# Altium schematic sheet P03_GPIO.SchDoc
size C; SheetNumber: 3; SheetTotal: 3
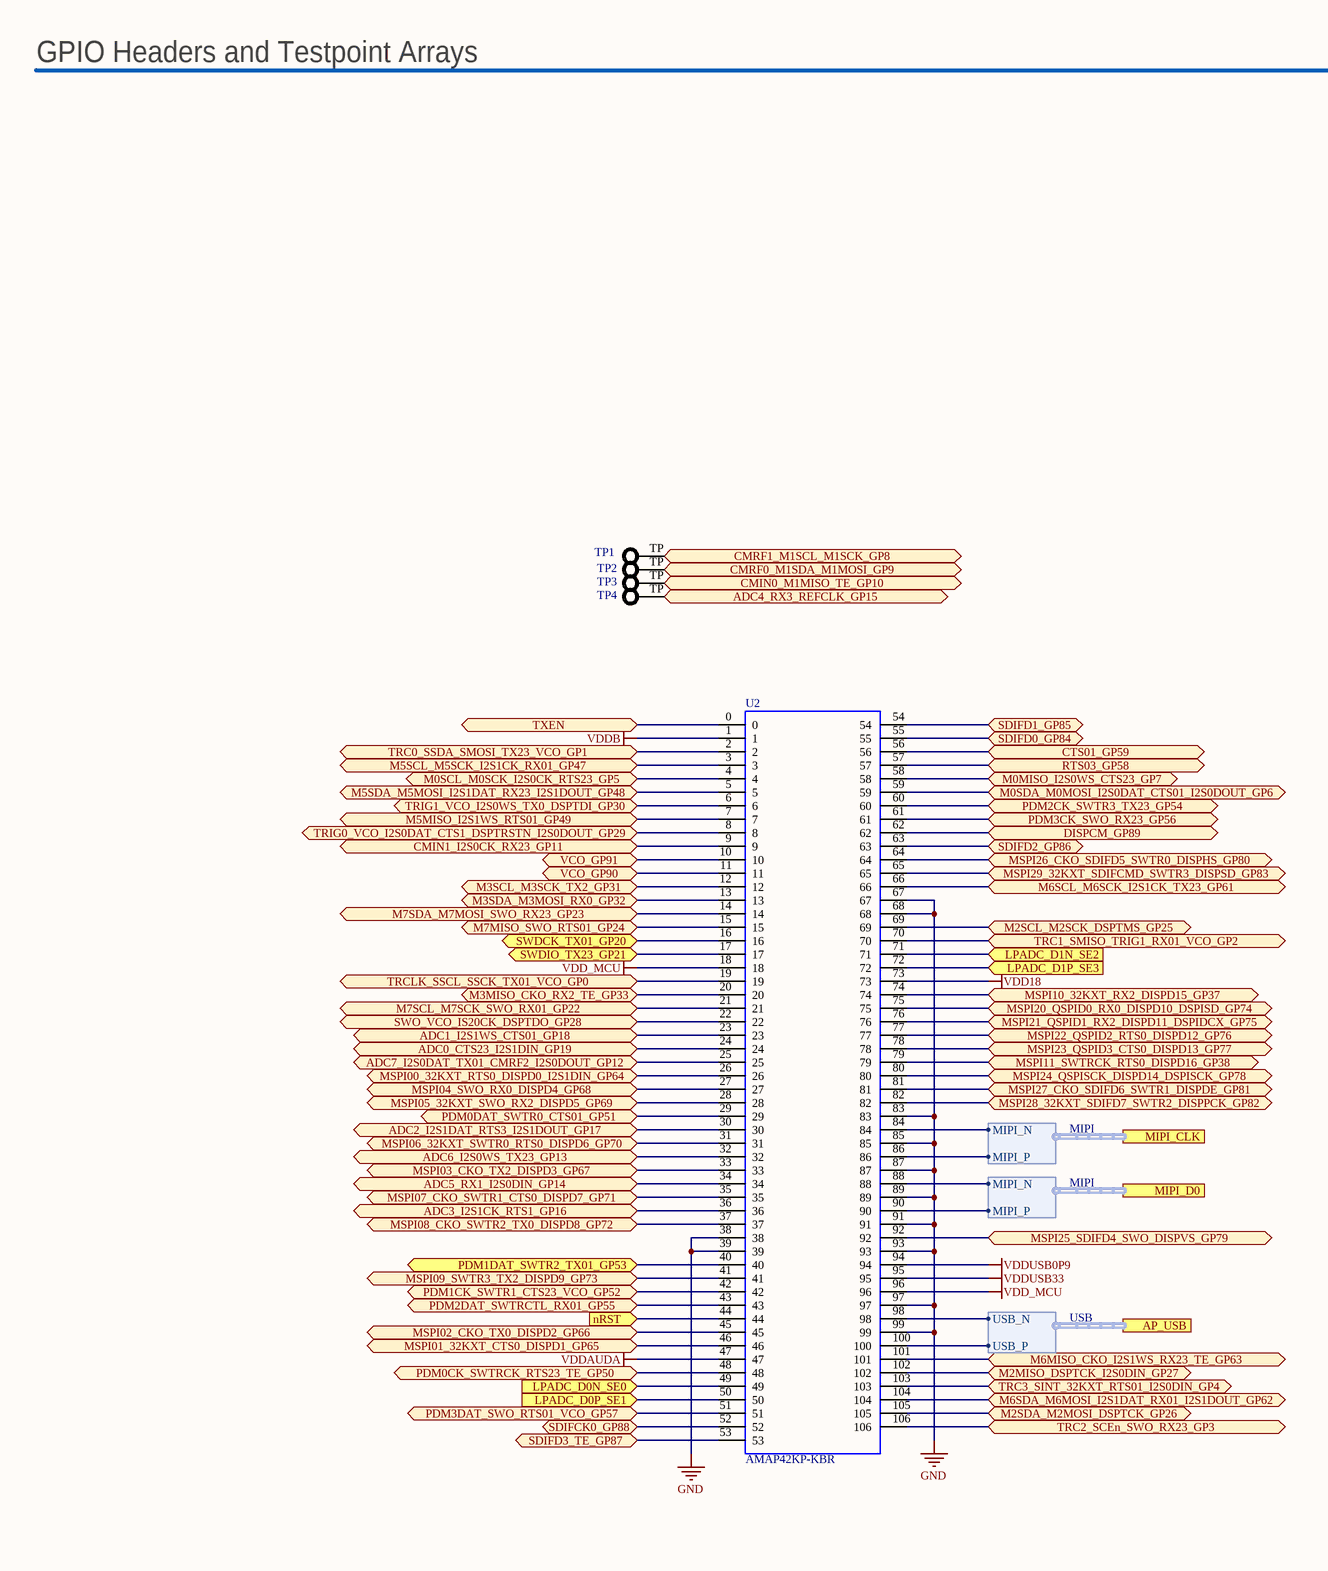
[diagram p0: P03_GPIO.SchDoc, left]
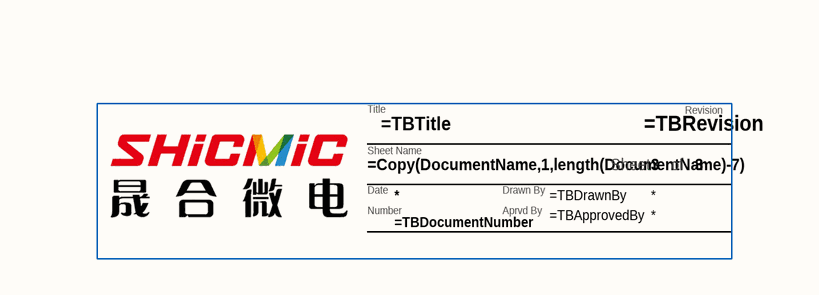
[diagram p1: P03_GPIO.SchDoc, right]

## Parts
??  TitleBlock  (value not drawn)  (graphical)
TP1  PAD  [TPPAD_0.5mm]  (value not drawn)  (no BOM)
TP2  PAD  [TPPAD_0.5mm]  (value not drawn)  (no BOM)
TP3  PAD  [TPPAD_0.5mm]  (value not drawn)  (no BOM)
TP4  PAD  [TPPAD_0.5mm]  (value not drawn)  (no BOM)
U2  AMAP42KP-KBR  [Apollo_4B]

## Ports
ADC0_CTS23_I2S1DIN_GP19 (bidir), ADC1_I2S1WS_CTS01_GP18 (bidir), ADC2_I2S1DAT_RTS3_I2S1DOUT_GP17 (bidir), ADC3_I2S1CK_RTS1_GP16 (bidir), ADC4_RX3_REFCLK_GP15 (bidir), ADC5_RX1_I2S0DIN_GP14 (bidir), ADC6_I2S0WS_TX23_GP13 (bidir), ADC7_I2S0DAT_TX01_CMRF2_I2S0DOUT_GP12 (bidir), AP_USB (harness USB), CMIN0_M1MISO_TE_GP10 (bidir), CMIN1_I2S0CK_RX23_GP11 (bidir), CMRF0_M1SDA_M1MOSI_GP9 (bidir), CMRF1_M1SCL_M1SCK_GP8 (bidir), CTS01_GP59 (bidir), DISPCM_GP89 (bidir), LPADC_D0N_SE0 (in), LPADC_D0P_SE1 (in), LPADC_D1N_SE2 (in), LPADC_D1P_SE3 (in), M0MISO_I2S0WS_CTS23_GP7 (bidir), M0SCL_M0SCK_I2S0CK_RTS23_GP5 (bidir), M0SDA_M0MOSI_I2S0DAT_CTS01_I2S0DOUT_GP6 (bidir), M2MISO_DSPTCK_I2S0DIN_GP27 (bidir), M2SCL_M2SCK_DSPTMS_GP25 (bidir), M2SDA_M2MOSI_DSPTCK_GP26 (bidir), M3MISO_CKO_RX2_TE_GP33 (bidir), M3SCL_M3SCK_TX2_GP31 (bidir), M3SDA_M3MOSI_RX0_GP32 (bidir), M5MISO_I2S1WS_RTS01_GP49 (bidir), M5SCL_M5SCK_I2S1CK_RX01_GP47 (bidir), M5SDA_M5MOSI_I2S1DAT_RX23_I2S1DOUT_GP48 (bidir), M6MISO_CKO_I2S1WS_RX23_TE_GP63 (bidir), M6SCL_M6SCK_I2S1CK_TX23_GP61 (bidir), M6SDA_M6MOSI_I2S1DAT_RX01_I2S1DOUT_GP62 (bidir), M7MISO_SWO_RTS01_GP24 (bidir), M7SCL_M7SCK_SWO_RX01_GP22 (bidir), M7SDA_M7MOSI_SWO_RX23_GP23 (bidir), MIPI_CLK (harness MIPI), MIPI_D0 (harness MIPI), MSPI00_32KXT_RTS0_DISPD0_I2S1DIN_GP64 (bidir), MSPI01_32KXT_CTS0_DISPD1_GP65 (bidir), MSPI02_CKO_TX0_DISPD2_GP66 (bidir), MSPI03_CKO_TX2_DISPD3_GP67 (bidir), MSPI04_SWO_RX0_DISPD4_GP68 (bidir), MSPI05_32KXT_SWO_RX2_DISPD5_GP69 (bidir), MSPI06_32KXT_SWTR0_RTS0_DISPD6_GP70 (bidir), MSPI07_CKO_SWTR1_CTS0_DISPD7_GP71 (bidir), MSPI08_CKO_SWTR2_TX0_DISPD8_GP72 (bidir), MSPI09_SWTR3_TX2_DISPD9_GP73 (bidir), MSPI10_32KXT_RX2_DISPD15_GP37 (bidir), MSPI11_SWTRCK_RTS0_DISPD16_GP38 (bidir), MSPI20_QSPID0_RX0_DISPD10_DSPISD_GP74 (bidir), MSPI21_QSPID1_RX2_DISPD11_DSPIDCX_GP75 (bidir), MSPI22_QSPID2_RTS0_DISPD12_GP76 (bidir), MSPI23_QSPID3_CTS0_DISPD13_GP77 (bidir), MSPI24_QSPISCK_DISPD14_DSPISCK_GP78 (bidir), MSPI25_SDIFD4_SWO_DISPVS_GP79 (bidir), MSPI26_CKO_SDIFD5_SWTR0_DISPHS_GP80 (bidir), MSPI27_CKO_SDIFD6_SWTR1_DISPDE_GP81 (bidir), MSPI28_32KXT_SDIFD7_SWTR2_DISPPCK_GP82 (bidir), MSPI29_32KXT_SDIFCMD_SWTR3_DISPSD_GP83 (bidir), nRST (in), PDM0CK_SWTRCK_RTS23_TE_GP50 (bidir), PDM0DAT_SWTR0_CTS01_GP51 (bidir), PDM1CK_SWTR1_CTS23_VCO_GP52 (bidir), PDM1DAT_SWTR2_TX01_GP53 (bidir), PDM2CK_SWTR3_TX23_GP54 (bidir), PDM2DAT_SWTRCTL_RX01_GP55 (bidir), PDM3CK_SWO_RX23_GP56 (bidir), PDM3DAT_SWO_RTS01_VCO_GP57 (bidir), RTS03_GP58 (bidir), SDIFCK0_GP88 (bidir), SDIFD0_GP84 (bidir), SDIFD1_GP85 (bidir), SDIFD2_GP86 (bidir), SDIFD3_TE_GP87 (bidir), SWDCK_TX01_GP20 (bidir), SWDIO_TX23_GP21 (bidir), SWO_VCO_IS20CK_DSPTDO_GP28 (bidir), TRC0_SSDA_SMOSI_TX23_VCO_GP1 (bidir), TRC1_SMISO_TRIG1_RX01_VCO_GP2 (bidir), TRC2_SCEn_SWO_RX23_GP3 (bidir), TRC3_SINT_32KXT_RTS01_I2S0DIN_GP4 (bidir), TRCLK_SSCL_SSCK_TX01_VCO_GP0 (bidir), TRIG0_VCO_I2S0DAT_CTS1_DSPTRSTN_I2S0DOUT_GP29 (bidir), TRIG1_VCO_I2S0WS_TX0_DSPTDI_GP30 (bidir), TXEN (bidir), VCO_GP90 (bidir), VCO_GP91 (bidir)

## Harnesses
USB: USB_N, USB_P
MIPI: MIPI_N, MIPI_P

## Nets
GND: U2.38 U2.39 U2.67 U2.68 U2.83 U2.85 U2.87 U2.89 U2.91 U2.93 U2.97 U2.99
VDD18: U2.73
VDD_MCU: U2.18 U2.96
VDDAUDA: U2.47
VDDB: U2.1
VDDUSB0P9: U2.94
VDDUSB33: U2.95
ADC0_CTS23_I2S1DIN_GP19: U2.24 ; port ADC0_CTS23_I2S1DIN_GP19
ADC1_I2S1WS_CTS01_GP18: U2.23 ; port ADC1_I2S1WS_CTS01_GP18
ADC2_I2S1DAT_RTS3_I2S1DOUT_GP17: U2.30 ; port ADC2_I2S1DAT_RTS3_I2S1DOUT_GP17
ADC3_I2S1CK_RTS1_GP16: U2.36 ; port ADC3_I2S1CK_RTS1_GP16
ADC4_RX3_REFCLK_GP15: TP4.TP ; port ADC4_RX3_REFCLK_GP15
ADC5_RX1_I2S0DIN_GP14: U2.34 ; port ADC5_RX1_I2S0DIN_GP14
ADC6_I2S0WS_TX23_GP13: U2.32 ; port ADC6_I2S0WS_TX23_GP13
ADC7_I2S0DAT_TX01_CMRF2_I2S0DOUT_GP12: U2.25 ; port ADC7_I2S0DAT_TX01_CMRF2_I2S0DOUT_GP12
CMIN0_M1MISO_TE_GP10: TP3.TP ; port CMIN0_M1MISO_TE_GP10
CMIN1_I2S0CK_RX23_GP11: U2.9 ; port CMIN1_I2S0CK_RX23_GP11
CMRF0_M1SDA_M1MOSI_GP9: TP2.TP ; port CMRF0_M1SDA_M1MOSI_GP9
CMRF1_M1SCL_M1SCK_GP8: TP1.TP ; port CMRF1_M1SCL_M1SCK_GP8
CTS01_GP59: U2.56 ; port CTS01_GP59
DISPCM_GP89: U2.62 ; port DISPCM_GP89
LPADC_D0N_SE0: U2.49 ; port LPADC_D0N_SE0
LPADC_D0P_SE1: U2.50 ; port LPADC_D0P_SE1
LPADC_D1N_SE2: U2.71 ; port LPADC_D1N_SE2
LPADC_D1P_SE3: U2.72 ; port LPADC_D1P_SE3
M0MISO_I2S0WS_CTS23_GP7: U2.58 ; port M0MISO_I2S0WS_CTS23_GP7
M0SCL_M0SCK_I2S0CK_RTS23_GP5: U2.4 ; port M0SCL_M0SCK_I2S0CK_RTS23_GP5
M0SDA_M0MOSI_I2S0DAT_CTS01_I2S0DOUT_GP6: U2.59 ; port M0SDA_M0MOSI_I2S0DAT_CTS01_I2S0DOUT_GP6
M2MISO_DSPTCK_I2S0DIN_GP27: U2.102 ; port M2MISO_DSPTCK_I2S0DIN_GP27
M2SCL_M2SCK_DSPTMS_GP25: U2.69 ; port M2SCL_M2SCK_DSPTMS_GP25
M2SDA_M2MOSI_DSPTCK_GP26: U2.105 ; port M2SDA_M2MOSI_DSPTCK_GP26
M3MISO_CKO_RX2_TE_GP33: U2.20 ; port M3MISO_CKO_RX2_TE_GP33
M3SCL_M3SCK_TX2_GP31: U2.12 ; port M3SCL_M3SCK_TX2_GP31
M3SDA_M3MOSI_RX0_GP32: U2.13 ; port M3SDA_M3MOSI_RX0_GP32
M5MISO_I2S1WS_RTS01_GP49: U2.7 ; port M5MISO_I2S1WS_RTS01_GP49
M5SCL_M5SCK_I2S1CK_RX01_GP47: U2.3 ; port M5SCL_M5SCK_I2S1CK_RX01_GP47
M5SDA_M5MOSI_I2S1DAT_RX23_I2S1DOUT_GP48: U2.5 ; port M5SDA_M5MOSI_I2S1DAT_RX23_I2S1DOUT_GP48
M6MISO_CKO_I2S1WS_RX23_TE_GP63: U2.101 ; port M6MISO_CKO_I2S1WS_RX23_TE_GP63
M6SCL_M6SCK_I2S1CK_TX23_GP61: U2.66 ; port M6SCL_M6SCK_I2S1CK_TX23_GP61
M6SDA_M6MOSI_I2S1DAT_RX01_I2S1DOUT_GP62: U2.104 ; port M6SDA_M6MOSI_I2S1DAT_RX01_I2S1DOUT_GP62
M7MISO_SWO_RTS01_GP24: U2.15 ; port M7MISO_SWO_RTS01_GP24
M7SCL_M7SCK_SWO_RX01_GP22: U2.21 ; port M7SCL_M7SCK_SWO_RX01_GP22
M7SDA_M7MOSI_SWO_RX23_GP23: U2.14 ; port M7SDA_M7MOSI_SWO_RX23_GP23
MSPI00_32KXT_RTS0_DISPD0_I2S1DIN_GP64: U2.26 ; port MSPI00_32KXT_RTS0_DISPD0_I2S1DIN_GP64
MSPI01_32KXT_CTS0_DISPD1_GP65: U2.46 ; port MSPI01_32KXT_CTS0_DISPD1_GP65
MSPI02_CKO_TX0_DISPD2_GP66: U2.45 ; port MSPI02_CKO_TX0_DISPD2_GP66
MSPI03_CKO_TX2_DISPD3_GP67: U2.33 ; port MSPI03_CKO_TX2_DISPD3_GP67
MSPI04_SWO_RX0_DISPD4_GP68: U2.27 ; port MSPI04_SWO_RX0_DISPD4_GP68
MSPI05_32KXT_SWO_RX2_DISPD5_GP69: U2.28 ; port MSPI05_32KXT_SWO_RX2_DISPD5_GP69
MSPI06_32KXT_SWTR0_RTS0_DISPD6_GP70: U2.31 ; port MSPI06_32KXT_SWTR0_RTS0_DISPD6_GP70
MSPI07_CKO_SWTR1_CTS0_DISPD7_GP71: U2.35 ; port MSPI07_CKO_SWTR1_CTS0_DISPD7_GP71
MSPI08_CKO_SWTR2_TX0_DISPD8_GP72: U2.37 ; port MSPI08_CKO_SWTR2_TX0_DISPD8_GP72
MSPI09_SWTR3_TX2_DISPD9_GP73: U2.41 ; port MSPI09_SWTR3_TX2_DISPD9_GP73
MSPI10_32KXT_RX2_DISPD15_GP37: U2.74 ; port MSPI10_32KXT_RX2_DISPD15_GP37
MSPI11_SWTRCK_RTS0_DISPD16_GP38: U2.79 ; port MSPI11_SWTRCK_RTS0_DISPD16_GP38
MSPI20_QSPID0_RX0_DISPD10_DSPISD_GP74: U2.75 ; port MSPI20_QSPID0_RX0_DISPD10_DSPISD_GP74
MSPI21_QSPID1_RX2_DISPD11_DSPIDCX_GP75: U2.76 ; port MSPI21_QSPID1_RX2_DISPD11_DSPIDCX_GP75
MSPI22_QSPID2_RTS0_DISPD12_GP76: U2.77 ; port MSPI22_QSPID2_RTS0_DISPD12_GP76
MSPI23_QSPID3_CTS0_DISPD13_GP77: U2.78 ; port MSPI23_QSPID3_CTS0_DISPD13_GP77
MSPI24_QSPISCK_DISPD14_DSPISCK_GP78: U2.80 ; port MSPI24_QSPISCK_DISPD14_DSPISCK_GP78
MSPI25_SDIFD4_SWO_DISPVS_GP79: U2.92 ; port MSPI25_SDIFD4_SWO_DISPVS_GP79
MSPI26_CKO_SDIFD5_SWTR0_DISPHS_GP80: U2.64 ; port MSPI26_CKO_SDIFD5_SWTR0_DISPHS_GP80
MSPI27_CKO_SDIFD6_SWTR1_DISPDE_GP81: U2.81 ; port MSPI27_CKO_SDIFD6_SWTR1_DISPDE_GP81
MSPI28_32KXT_SDIFD7_SWTR2_DISPPCK_GP82: U2.82 ; port MSPI28_32KXT_SDIFD7_SWTR2_DISPPCK_GP82
MSPI29_32KXT_SDIFCMD_SWTR3_DISPSD_GP83: U2.65 ; port MSPI29_32KXT_SDIFCMD_SWTR3_DISPSD_GP83
nRST: U2.44 ; port nRST
PDM0CK_SWTRCK_RTS23_TE_GP50: U2.48 ; port PDM0CK_SWTRCK_RTS23_TE_GP50
PDM0DAT_SWTR0_CTS01_GP51: U2.29 ; port PDM0DAT_SWTR0_CTS01_GP51
PDM1CK_SWTR1_CTS23_VCO_GP52: U2.42 ; port PDM1CK_SWTR1_CTS23_VCO_GP52
PDM1DAT_SWTR2_TX01_GP53: U2.40 ; port PDM1DAT_SWTR2_TX01_GP53
PDM2CK_SWTR3_TX23_GP54: U2.60 ; port PDM2CK_SWTR3_TX23_GP54
PDM2DAT_SWTRCTL_RX01_GP55: U2.43 ; port PDM2DAT_SWTRCTL_RX01_GP55
PDM3CK_SWO_RX23_GP56: U2.61 ; port PDM3CK_SWO_RX23_GP56
PDM3DAT_SWO_RTS01_VCO_GP57: U2.51 ; port PDM3DAT_SWO_RTS01_VCO_GP57
RTS03_GP58: U2.57 ; port RTS03_GP58
SDIFCK0_GP88: U2.52 ; port SDIFCK0_GP88
SDIFD0_GP84: U2.55 ; port SDIFD0_GP84
SDIFD1_GP85: U2.54 ; port SDIFD1_GP85
SDIFD2_GP86: U2.63 ; port SDIFD2_GP86
SDIFD3_TE_GP87: U2.53 ; port SDIFD3_TE_GP87
SWDCK_TX01_GP20: U2.16 ; port SWDCK_TX01_GP20
SWDIO_TX23_GP21: U2.17 ; port SWDIO_TX23_GP21
SWO_VCO_IS20CK_DSPTDO_GP28: U2.22 ; port SWO_VCO_IS20CK_DSPTDO_GP28
TRC0_SSDA_SMOSI_TX23_VCO_GP1: U2.2 ; port TRC0_SSDA_SMOSI_TX23_VCO_GP1
TRC1_SMISO_TRIG1_RX01_VCO_GP2: U2.70 ; port TRC1_SMISO_TRIG1_RX01_VCO_GP2
TRC2_SCEn_SWO_RX23_GP3: U2.106 ; port TRC2_SCEn_SWO_RX23_GP3
TRC3_SINT_32KXT_RTS01_I2S0DIN_GP4: U2.103 ; port TRC3_SINT_32KXT_RTS01_I2S0DIN_GP4
TRCLK_SSCL_SSCK_TX01_VCO_GP0: U2.19 ; port TRCLK_SSCL_SSCK_TX01_VCO_GP0
TRIG0_VCO_I2S0DAT_CTS1_DSPTRSTN_I2S0DOUT_GP29: U2.8 ; port TRIG0_VCO_I2S0DAT_CTS1_DSPTRSTN_I2S0DOUT_GP29
TRIG1_VCO_I2S0WS_TX0_DSPTDI_GP30: U2.6 ; port TRIG1_VCO_I2S0WS_TX0_DSPTDI_GP30
TXEN: U2.0 ; port TXEN
VCO_GP90: U2.11 ; port VCO_GP90
VCO_GP91: U2.10 ; port VCO_GP91
NetU2_84: U2.84 ; port MIPI_CLK.MIPI_N
NetU2_86: U2.86 ; port MIPI_CLK.MIPI_P
NetU2_88: U2.88 ; port MIPI_D0.MIPI_N
NetU2_90: U2.90 ; port MIPI_D0.MIPI_P
NetU2_98: U2.98 ; port AP_USB.USB_N
NetU2_100: U2.100 ; port AP_USB.USB_P

## Notes on the sheet
- GPIO Headers and Testpoint Arrays
- (in symbol TitleBlock) Revision; Title; Sheet Name; Sheet; of; Date; Drawn By; Number; Aprvd By

## Library data of the parts
?? = TitleBlock: Title block for Ambiq Schematics. Please have the following parameters entered in Project>Project Options>Parameters: / TBTitle / TBDocumentNumber / TBRevision / TBDrawnBy / TBApprovedBy; AMBIQ PN: TitleBlock
TP1-TP4 = TP_PAD: None; AMBIQ PN: TP_PAD
U2 = APOLLO4B_OUT: None; AMBIQ PN: APOLLO4P; Category: Microcontrollers